# EAGLE schematic placa_Principal (EAGLE 9.5.1)
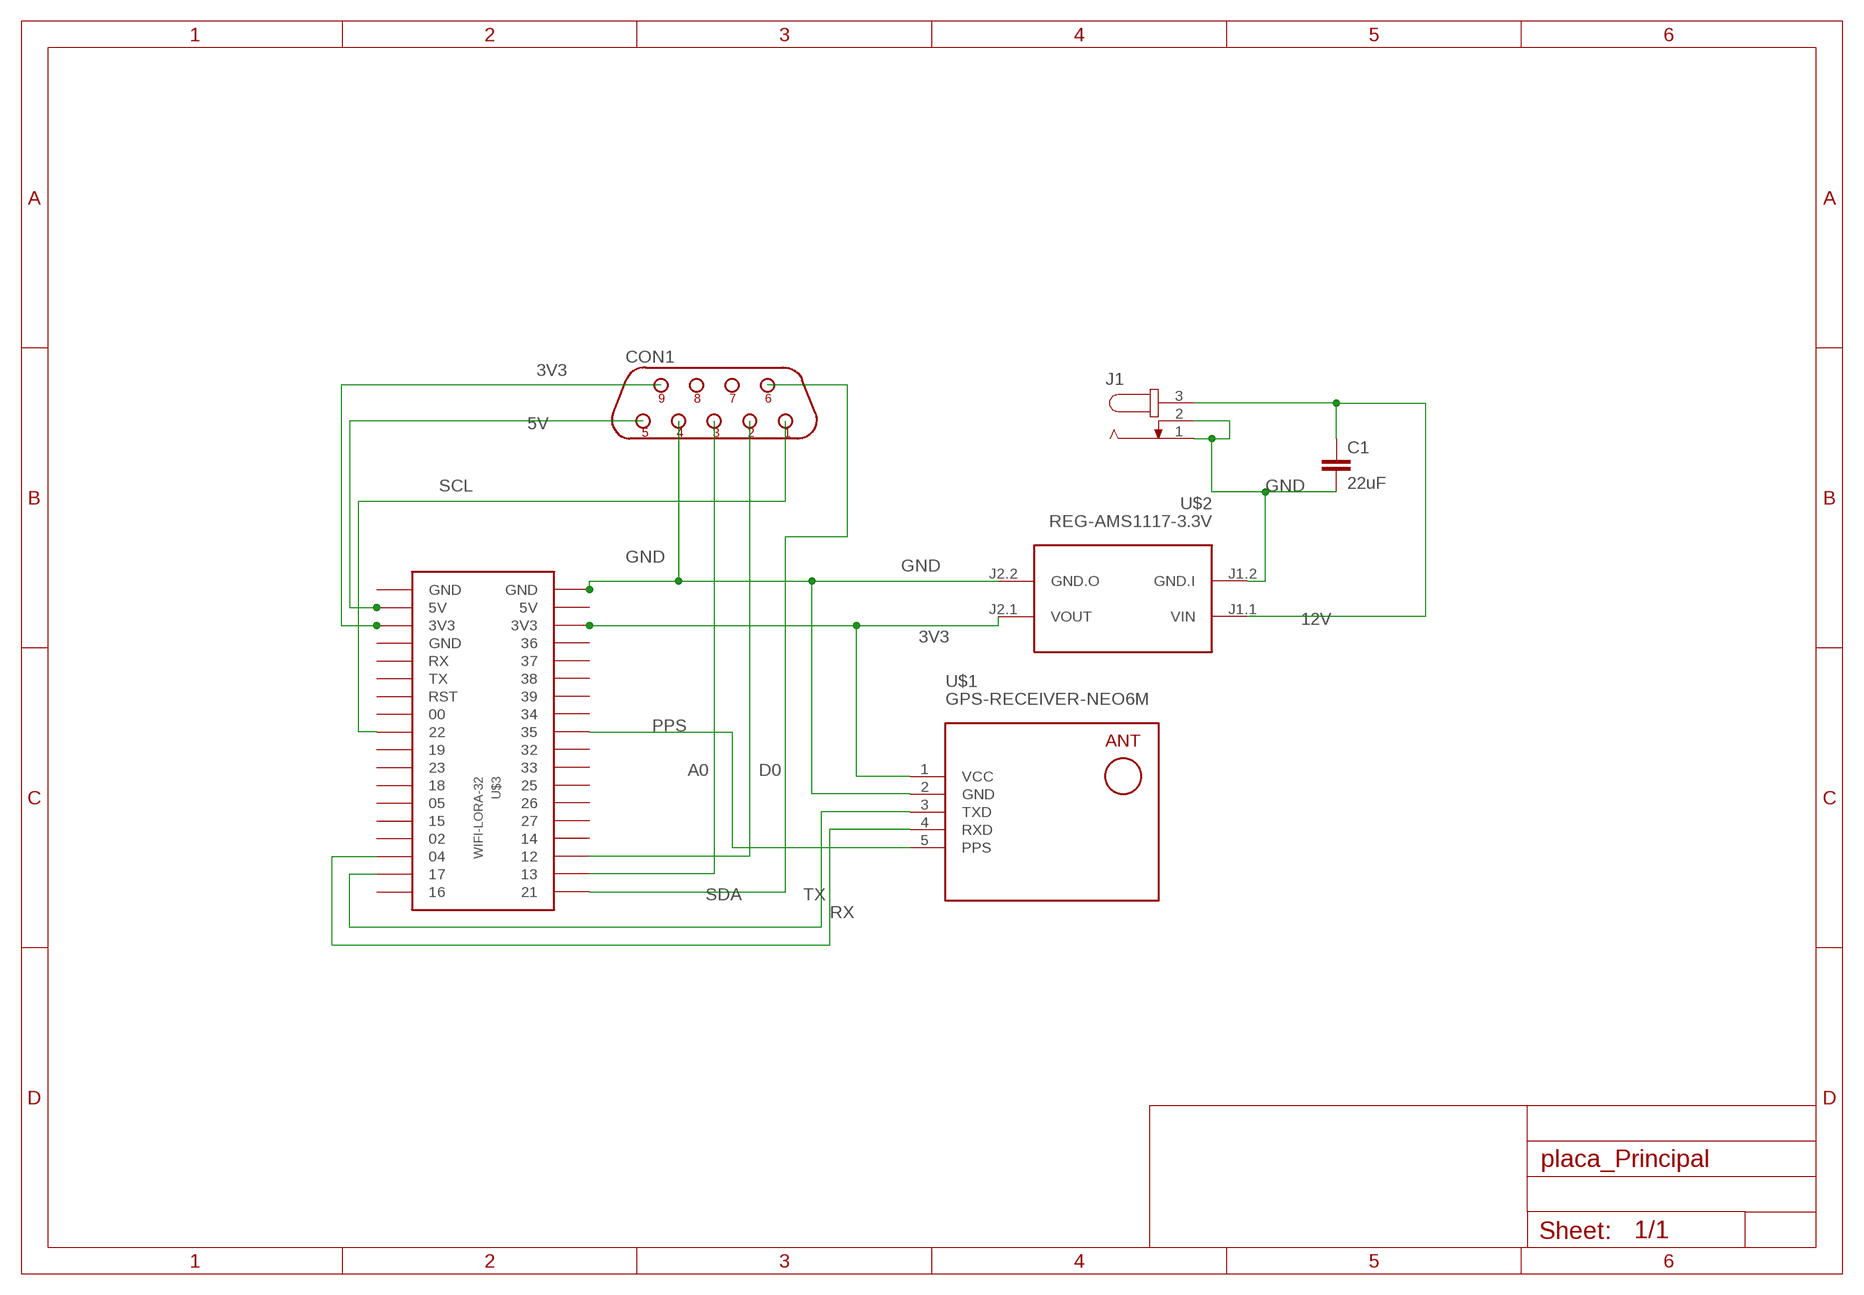
[diagram p0: schematic, sheet 1]

## Parts
C1  22uF  C2.5/4  [C2.5-4]
CON1  DB9F  [D-09F]
J1  JACK-PLUG1  [SPC4078]
U$1  GPS-RECEIVER-NEO6M  [GPS-RECEIVER-NEO6M]
U$2  REG-AMS1117-3.3V  [REG-AMS1117]
U$3  WIFI-LORA-32  [2.54MM_2X18]

## Nets
3V3: CON1.9 U$1.1(VCC) U$2.J2.1(VOUT) U$3.P$3(3V3) U$3.P$34(3V3)
5V: CON1.5 U$3.P$2(5V)
12V: C1.1 J1.3 U$2.J1.1(VIN)
A0: CON1.3 U$3.P$20
D0: CON1.2 U$3.P$21
GND: C1.2 CON1.4 J1.1 J1.2 U$1.2(GND) U$2.J1.2(GND.I) U$2.J2.2(GND.O) U$3.P$36(GND)
PPS: U$1.5(PPS) U$3.P$28
RX: U$1.4(RXD) U$3.P$16
SCL: CON1.1 U$3.P$9
SDA: CON1.6 U$3.P$19
TX: U$1.3(TXD) U$3.P$17
Unconnected: CON1.7 CON1.8 U$3.P$1(GND) U$3.P$4(GND) U$3.P$5(RX) U$3.P$6(TX) U$3.P$7(RST) U$3.P$8 U$3.P$10 U$3.P$11 U$3.P$12 U$3.P$13 U$3.P$14 U$3.P$15 U$3.P$18 U$3.P$22 U$3.P$23 U$3.P$24 U$3.P$25 U$3.P$26 U$3.P$27 U$3.P$29 U$3.P$30 U$3.P$31 U$3.P$32 U$3.P$33 U$3.P$35(5V)

## Library data of the parts
C1 = capacitor-wima:C: CAPACITOR naming: grid - package width
CON1 = connect:DB9F
J1 = con-jack:JACK-PLUG: DC POWER JACK Power Jack, DC, Right Angle, Through Hole, Rated 5A at 16VDC, PC Terminals Distributor: Farnell (www.Farnell.de) Drawing: 84N1161.pdf / 84N1162.pdf Manufacturer: SPC Technology (www.spctechnology.com) Type: SPC4077 / SPC 4078; OC_FARNELL: unknown; OC_NEWARK: unknown
U$1 = diy-modules:GPS-RECEIVER-NEO6M: GPS Receiver Module based on NEO-6 device Short tutorial how to use NEO-6 module with Arduino: http://www.xarg.org/2016/06/neo6mv2-gps-module-with-arduino/ NEO-6 datasheet is available here: https://www.u-blox.com/sites/default/files/products/documents/NEO-6_DataSheet_%28GPS.G6-HW-09005%29.pdf Click here to find device on ebay.com <http://www.ebay.com/sch/gyneo6mv2>
U$2 = diy-modules:REG-AMS1117-*: Linear Regulator based on AMS1117 chip
U$3 = ESP32_modules:WIFI-LORA-32